# EAGLE design UNDER_FAST (EAGLE 9.6.2)
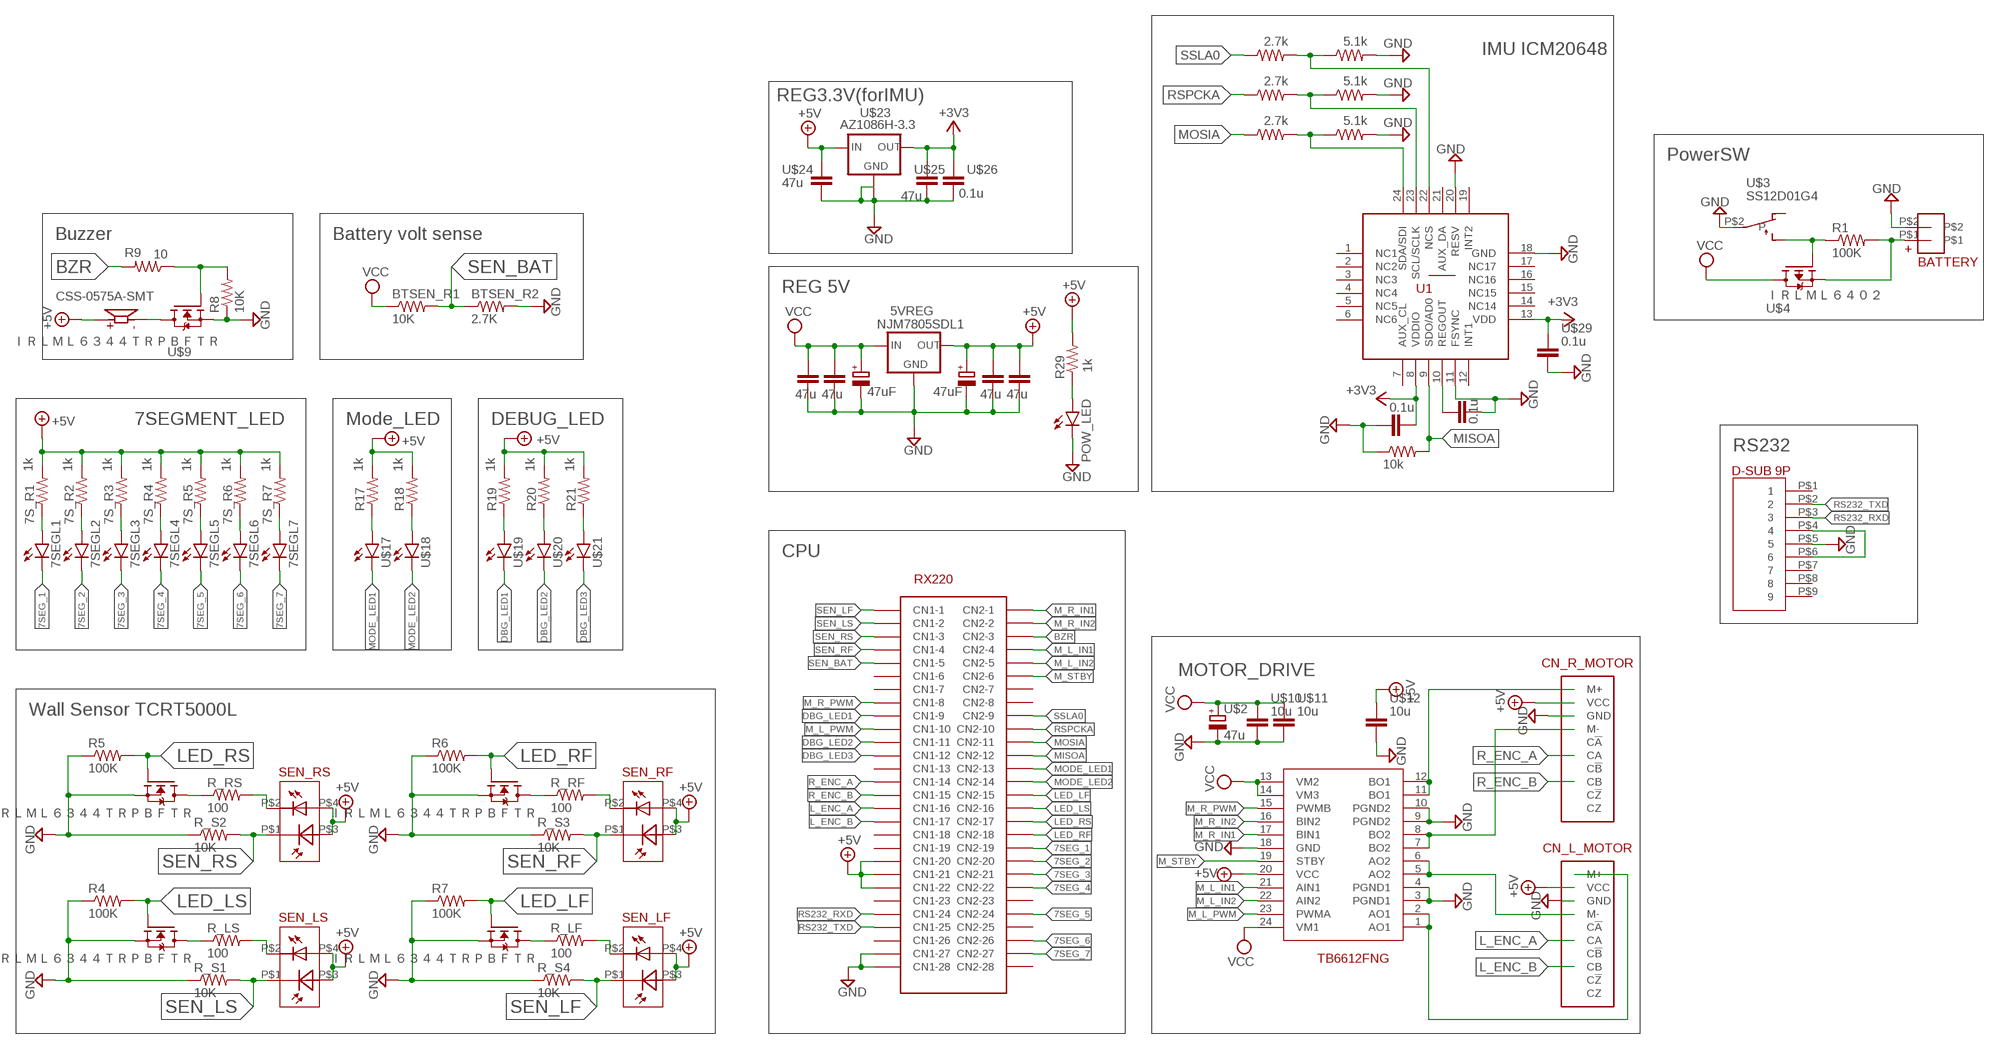
[diagram p0: schematic, sheet 1]

## Parts
5VREG  NJM7805SDL1  [TO252]
7S_R1  1k  ERJ-2RKF1001X  [RESC1005X40N]
7S_R2  1k  ERJ-2RKF1001X  [RESC1005X40N]
7S_R3  1k  ERJ-2RKF1001X  [RESC1005X40N]
7S_R4  1k  ERJ-2RKF1001X  [RESC1005X40N]
7S_R5  1k  ERJ-2RKF1001X  [RESC1005X40N]
7S_R6  1k  ERJ-2RKF1001X  [RESC1005X40N]
7S_R7  1k  ERJ-2RKF1001X  [RESC1005X40N]
7SEGL1  LED1608  [LED1608]
7SEGL2  LED1608  [LED1608]
7SEGL3  LED1608  [LED1608]
7SEGL4  LED1608  [LED1608]
7SEGL5  LED1608  [LED1608]
7SEGL6  LED1608  [LED1608]
7SEGL7  LED1608  [LED1608]
BATTERY  DF3A_2P_2DSA_CONNECTOR  [DF3A_2P_2DSA_CONNECTOR]
BTSEN_R1  10K  ERJ-2RKF1001X  [RESC1005X40N]
BTSEN_R2  2.7K  ERJ-2RKF1001X  [RESC1005X40N]
C1  47u  C3225  [CAPC3225X270N]
C2  47u  C3225  [CAPC3225X270N]
C3  47u  C3225  [CAPC3225X270N]
C4  47u  C3225  [CAPC3225X270N]
CLK_R1  2.7k  ERJ-2RKF1001X  [RESC1005X40N]
CLK_R2  5.1k  ERJ-2RKF1001X  [RESC1005X40N]
CN_L_MOTOR  CN_MOTOR  [CN_MOTOR]
CN_R_MOTOR  CN_MOTOR  [CN_MOTOR]
EC1  47uF  EEE-HC1E470XP  [CAPAE660X800N]
EC2  47uF  EEE-HC1E470XP  [CAPAE660X800N]
LS1  CSS-0575A-SMT  [CUI_CSS-0575A-SMT]
MISO_R  10k  ERJ-2RKF1001X  [RESC1005X40N]
MOSI_R1  2.7k  ERJ-2RKF1001X  [RESC1005X40N]
MOSI_R2  5.1k  ERJ-2RKF1001X  [RESC1005X40N]
NCS_R1  2.7k  ERJ-2RKF1001X  [RESC1005X40N]
NCS_R2  5.1k  ERJ-2RKF1001X  [RESC1005X40N]
POW_LED  LED1608  [LED1608]
R1  100K  ERJ-2RKF1001X  [RESC1005X40N]
R4  100K  ERJ-2RKF1001X  [RESC1005X40N]
R5  100K  ERJ-2RKF1001X  [RESC1005X40N]
R6  100K  ERJ-2RKF1001X  [RESC1005X40N]
R7  100K  ERJ-2RKF1001X  [RESC1005X40N]
R8  10K  ERJ-2RKF1001X  [RESC1005X40N]
R9  10  ERJ-2RKF1001X  [RESC1005X40N]
R17  1k  ERJ-2RKF1001X  [RESC1005X40N]
R18  1k  ERJ-2RKF1001X  [RESC1005X40N]
R19  1k  ERJ-2RKF1001X  [RESC1005X40N]
R20  1k  ERJ-2RKF1001X  [RESC1005X40N]
R21  1k  ERJ-2RKF1001X  [RESC1005X40N]
R29  1k  ERJ-2RKF1001X  [RESC1005X40N]
R_LF  100  ERJ-2RKF1001X  [RESC1005X40N]
R_LS  100  ERJ-2RKF1001X  [RESC1005X40N]
R_RF  100  ERJ-2RKF1001X  [RESC1005X40N]
R_RS  100  ERJ-2RKF1001X  [RESC1005X40N]
R_S1  10K  ERJ-2RKF1001X  [RESC1005X40N]
R_S2  10K  ERJ-2RKF1001X  [RESC1005X40N]
R_S3  10K  ERJ-2RKF1001X  [RESC1005X40N]
R_S4  10K  ERJ-2RKF1001X  [RESC1005X40N]
SEN_LF  TCRT5000L  [TCRT5000L_PHOTO]
SEN_LS  TCRT5000L  [TCRT5000L_PHOTO]
SEN_RF  TCRT5000L  [TCRT5000L_PHOTO]
SEN_RS  TCRT5000L  [TCRT5000L_PHOTO]
TB6612FNG  TB6612FNG  [SOP65P760X160-24N]
U1  ICM-20648  [QFN40P300X300X95-24N]
U$1  RX220_BOARD  [RX220_BOARD]
U$2  47u  EEE-HC1E470XP  [CAPAE660X800N]
U$3  SS12D01G4  [SS12D01G4]
U$4  ＩＲＬＭＬ６４０２  [SOT23]
U$5  ＩＲＬＭＬ６３４４ＴＲＰＢＦＴＲ  [SOT23]
U$6  ＩＲＬＭＬ６３４４ＴＲＰＢＦＴＲ  [SOT23]
U$7  ＩＲＬＭＬ６３４４ＴＲＰＢＦＴＲ  [SOT23]
U$8  ＩＲＬＭＬ６３４４ＴＲＰＢＦＴＲ  [SOT23]
U$9  ＩＲＬＭＬ６３４４ＴＲＰＢＦＴＲ  [SOT23]
U$10  10u  CL31A106KBHNNNE  [CAPC3216X180N]
U$11  10u  CL31A106KBHNNNE  [CAPC3216X180N]
U$12  10u  CL31A106KBHNNNE  [CAPC3216X180N]
U$13  D-SUB  [D-SUB]
U$17  LED1608  [LED1608]
U$18  LED1608  [LED1608]
U$19  LED1608  [LED1608]
U$20  LED1608  [LED1608]
U$21  LED1608  [LED1608]
U$23  AZ1086H-3.3  [SOT223]
U$24  47u  C3225  [CAPC3225X270N]
U$25  47u  C3225  [CAPC3225X270N]
U$26  0.1u  C1005  [CAPC1005X55N]
U$27  0.1u  C1005  [CAPC1005X55N]
U$28  0.1u  C1005  [CAPC1005X55N]
U$29  0.1u  C1005  [CAPC1005X55N]

## Nets
7SEG_1: 7SEGL1.P$2(C) U$1.P$47(CN2-19)
7SEG_2: 7SEGL2.P$2(C) U$1.P$48(CN2-20)
7SEG_3: 7SEGL3.P$2(C) U$1.P$49(CN2-21)
7SEG_4: 7SEGL4.P$2(C) U$1.P$50(CN2-22)
7SEG_5: 7SEGL5.P$2(C) U$1.P$52(CN2-24)
7SEG_6: 7SEGL6.P$2(C) U$1.P$54(CN2-26)
7SEG_7: 7SEGL7.P$2(C) U$1.P$55(CN2-27)
+3V3: U1.8(VDDIO) U1.13(VDD) U$23.2(OUT) U$25.1 U$26.1 U$28.1 U$29.1
+5V: 5VREG.2(OUT) 7S_R1.2 7S_R2.2 7S_R3.2 7S_R4.2 7S_R5.2 7S_R6.2 7S_R7.2 C3.1 C4.1 CN_L_MOTOR.P$2(VCC) CN_R_MOTOR.P$2(VCC) EC2.1(+) LS1.1(P) R17.2 R18.2 R19.2 R20.2 R21.2 R29.2 SEN_LF.P$3(DIODE+) SEN_LF.P$4(LED+) SEN_LS.P$3(DIODE+) SEN_LS.P$4(LED+) SEN_RF.P$3(DIODE+) SEN_RF.P$4(LED+) SEN_RS.P$3(DIODE+) SEN_RS.P$4(LED+) TB6612FNG.20(VCC) U$1.P$20(CN1-20) U$1.P$21(CN1-21) U$1.P$22(CN1-22) U$12.1 U$23.3(IN) U$24.1
BZR: R9.2 U$1.P$31(CN2-3)
DBG_LED1: U$1.P$9(CN1-9) U$19.P$2(C)
DBG_LED2: U$1.P$11(CN1-11) U$20.P$2(C)
DBG_LED3: U$1.P$12(CN1-12) U$21.P$2(C)
GND: 5VREG.3(GND) BATTERY.P$2 BTSEN_R2.2 C1.2 C2.2 C3.2 C4.2 CLK_R2.2 CN_L_MOTOR.P$3(GND) CN_R_MOTOR.P$3(GND) EC1.2(-) EC2.2(-) MISO_R.1 MOSI_R2.2 NCS_R2.2 POW_LED.P$2(C) R4.1 R5.1 R6.1 R7.1 R8.1 R_S1.1 R_S2.1 R_S3.1 R_S4.1 TB6612FNG.3(PGND1) TB6612FNG.4(PGND1) TB6612FNG.9(PGND2) TB6612FNG.10(PGND2) TB6612FNG.18(GND) U1.11(FSYNC) U1.18(GND) U1.20(RESV) U$1.P$27(CN1-27) U$1.P$28(CN1-28) U$2.2(-) U$3.P$2(P) U$5.2(S) U$6.2(S) U$7.2(S) U$8.2(S) U$9.2(S) U$10.2 U$11.2 U$12.2 U$13.P$5 U$23.1(GND) U$23.4(GND1) U$24.2 U$25.2 U$26.2 U$27.2 U$28.2 U$29.2
L_ENC_A: CN_L_MOTOR.P$6(CA) U$1.P$16(CN1-16)
L_ENC_B: CN_L_MOTOR.P$8(CB) U$1.P$17(CN1-17)
LED_LF: R7.2 U$1.P$43(CN2-15) U$8.1(G)
LED_LS: R4.2 U$1.P$44(CN2-16) U$6.1(G)
LED_RF: R6.2 U$1.P$46(CN2-18) U$7.1(G)
LED_RS: R5.2 U$1.P$45(CN2-17) U$5.1(G)
M_L_IN1: TB6612FNG.21(AIN1) U$1.P$32(CN2-4)
M_L_IN2: TB6612FNG.22(AIN2) U$1.P$33(CN2-5)
M_L_PWM: TB6612FNG.23(PWMA) U$1.P$10(CN1-10)
M_R_IN1: TB6612FNG.17(BIN1) U$1.P$29(CN2-1)
M_R_IN2: TB6612FNG.16(BIN2) U$1.P$30(CN2-2)
M_R_PWM: TB6612FNG.15(PWMB) U$1.P$8(CN1-8)
M_STBY: TB6612FNG.19(STBY) U$1.P$34(CN2-6)
MISOA: MISO_R.2 U1.9(SDO/AD0) U$1.P$40(CN2-12)
MODE_LED1: U$1.P$41(CN2-13) U$17.P$2(C)
MODE_LED2: U$1.P$42(CN2-14) U$18.P$2(C)
MOSIA: MOSI_R1.1 U$1.P$39(CN2-11)
N$1: BATTERY.P$1 R1.2 U$4.2(S)
N$2: R1.1 U$3.P$3(ON) U$4.1(G)
N$3: R_LS.2 SEN_LS.P$2(LED-)
N$4: R_LS.1 U$6.3(D)
N$5: R_RS.1 U$5.3(D)
N$6: R_RS.2 SEN_RS.P$2(LED-)
N$7: R_RF.1 U$7.3(D)
N$8: R_RF.2 SEN_RF.P$2(LED-)
N$9: R_LF.1 U$8.3(D)
N$10: R_LF.2 SEN_LF.P$2(LED-)
N$11: CN_R_MOTOR.P$1(M+) TB6612FNG.11(BO1) TB6612FNG.12(BO1)
N$12: R8.2 R9.1 U$9.1(G)
N$13: CN_R_MOTOR.P$4(M-) TB6612FNG.7(BO2) TB6612FNG.8(BO2)
N$14: CN_L_MOTOR.P$4(M-) TB6612FNG.5(AO2) TB6612FNG.6(AO2)
N$15: LS1.2(N) U$9.3(D)
N$16: CN_L_MOTOR.P$1(M+) TB6612FNG.1(AO1) TB6612FNG.2(AO1)
N$17: 7S_R1.1 7SEGL1.P$1(A)
N$18: 7S_R2.1 7SEGL2.P$1(A)
N$19: 7S_R3.1 7SEGL3.P$1(A)
N$20: 7S_R4.1 7SEGL4.P$1(A)
N$21: 7S_R5.1 7SEGL5.P$1(A)
N$22: 7S_R6.1 7SEGL6.P$1(A)
N$23: 7S_R7.1 7SEGL7.P$1(A)
N$24: R17.1 U$17.P$1(A)
N$25: R18.1 U$18.P$1(A)
N$26: R19.1 U$19.P$1(A)
N$27: R20.1 U$20.P$1(A)
N$28: R21.1 U$21.P$1(A)
N$29: U$13.P$4 U$13.P$6
N$30: MOSI_R1.2 MOSI_R2.1 U1.24(SDA/SDI)
N$31: CLK_R1.2 CLK_R2.1 U1.23(SCL/SCLK)
N$32: U1.10(REGOUT) U$27.1
N$33: NCS_R1.2 NCS_R2.1 U1.22(NCS)
N$34: POW_LED.P$1(A) R29.1
R_ENC_A: CN_R_MOTOR.P$6(CA) U$1.P$14(CN1-14)
R_ENC_B: CN_R_MOTOR.P$8(CB) U$1.P$15(CN1-15)
RS232_RXD: U$1.P$24(CN1-24) U$13.P$3
RS232_TXD: U$1.P$25(CN1-25) U$13.P$2
RSPCKA: CLK_R1.1 U$1.P$38(CN2-10)
SEN_BAT: BTSEN_R1.2 BTSEN_R2.1 U$1.P$5(CN1-5)
SEN_LF: R_S4.2 SEN_LF.P$1(DIODE-) U$1.P$1(CN1-1)
SEN_LS: R_S1.2 SEN_LS.P$1(DIODE-) U$1.P$2(CN1-2)
SEN_RF: R_S3.2 SEN_RF.P$1(DIODE-) U$1.P$4(CN1-4)
SEN_RS: R_S2.2 SEN_RS.P$1(DIODE-) U$1.P$3(CN1-3)
SSLA0: NCS_R1.1 U$1.P$37(CN2-9)
VCC: 5VREG.1(IN) BTSEN_R1.1 C1.1 C2.1 EC1.1(+) TB6612FNG.13(VM2) TB6612FNG.14(VM3) TB6612FNG.24(VM1) U$2.1(+) U$4.3(D) U$10.1 U$11.1
Unconnected: CN_L_MOTOR.P$5(C!A) CN_L_MOTOR.P$7(C!B) CN_L_MOTOR.P$9(C!Z) CN_L_MOTOR.P$10(CZ) CN_R_MOTOR.P$5(C!A) CN_R_MOTOR.P$7(C!B) CN_R_MOTOR.P$9(C!Z) CN_R_MOTOR.P$10(CZ) U1.1(NC1) U1.2(NC2) U1.3(NC3) U1.4(NC4) U1.5(NC5) U1.6(NC6) U1.7(AUX_CL) U1.12(INT1) U1.14(NC14) U1.15(NC15) U1.16(NC16) U1.17(NC17) U1.19(INT2) U1.21(AUX_DA) U1.P$2(PAD) U$1.P$6(CN1-6) U$1.P$7(CN1-7) U$1.P$13(CN1-13) U$1.P$18(CN1-18) U$1.P$19(CN1-19) U$1.P$23(CN1-23) U$1.P$26(CN1-26) U$1.P$35(CN2-7) U$1.P$36(CN2-8) U$1.P$51(CN2-23) U$1.P$53(CN2-25) U$1.P$56(CN2-28) U$3.P$1(OFF) U$13.P$1 U$13.P$7 U$13.P$8 U$13.P$9

## Notes on the sheet
- IMU ICM20648
- REG3.3V(forIMU)
- PowerSW
- Buzzer | Battery volt sense
- REG 5V
- 7SEGMENT_LED | Mode_LED | DEBUG_LED
- RS232
- CPU
- MOTOR_DRIVE
- Wall Sensor TCRT5000L

## Library data of the parts
5VREG = regulator:NJM7805SDL1
7S_R1-7S_R7 BTSEN_R1 BTSEN_R2 CLK_R1 CLK_R2 MISO_R MOSI_R1 MOSI_R2 NCS_R1 NCS_R2 R1 R4-R9 R17-R21 R29 R_LF R_LS R_RF R_RS R_S1-R_S4 = Resistor:ERJ-2RKF1001X: RESISTOR, 0402, 0.1W, 1%, 1K; DESCRIPTION: 1 kOhms ±1% 0.1W, 1/10W Chip Resistor 0402 (1005 Metric) Automotive AEC-Q200 Thick Film; DIGI-KEY_PART_NUMBER: P1.00KLCT-ND; MF: Panasonic; MP: ERJ-2RKF1001X; PACKAGE: 1005 Panasonic Electronic Components; PURCHASE-URL: https://pricing.snapeda.com/search/part/ERJ-2RKF1001X/?ref=eda
7SEGL1-7SEGL7 POW_LED U$17-U$21 = LED:LED1608
BATTERY = DF3A_2P_2DSA_CONNECTOR:DF3A_2P_2DSA_CONNECTOR
C1-C4 U$24 U$25 = capacitor:C3225
CN_L_MOTOR CN_R_MOTOR = CN_MOTOR:CN_MOTOR
EC1 EC2 U$2 = capacitor:EEE-HC1E470XP
LS1 = CSS-0575A-SMT:CSS-0575A-SMT: 5 mm, 3 V, 75 dB, Surface Mount (SMT), Magnetic Audio Transducer Buzzer; CUI_PURCHASE_URL: https://www.cuidevices.com/product/audio/buzzers/audio-transducers/css-0575a-smt-tr?utm_source=snapeda.com&utm_medium=referral&utm_campaign=snapedaBOM; DESCRIPTION: 5 mm, 3 V, 76 dB, Surface Mount (SMT), Magnetic Audio Transducer Buzzer; DIGI-KEY_PART_NUMBER: 102-2201-1-ND; MF: CUI Devices; MP: CSS-0575A-SMT-TR; PACKAGE: 6-DIP-6 CUI; PURCHASE-URL: https://pricing.snapeda.com/search/part/CSS-0575A-SMT-TR/?ref=eda
SEN_LF SEN_LS SEN_RF SEN_RS = PHOTO:TCRT5000L
TB6612FNG = TB6612FNG:TB6612FNG
U1 = ICM-20648:ICM-20648: 6-Axis Gyro/Accel Integrated Sol; DESCRIPTION: Accelerometer, Gyroscope, Temperature, 6 Axis Sensor I²C, SPI Output; DIGI-KEY_PART_NUMBER: 1428-1061-1-ND; MF: TDK InvenSense; MP: ICM-20648; PACKAGE: QFN-24 TDK; PURCHASE-URL: https://pricing.snapeda.com/search/part/ICM-20648/?ref=eda
U$1 = CPU:RX220_BOARD
U$3 = SlideSwitch:SS12D01G4
U$4 = FET:ＩＲＬＭＬ６４０２
U$5-U$9 = FET:ＩＲＬＭＬ６３４４ＴＲＰＢＦＴＲ
U$10-U$12 = capacitor:CL31A106KBHNNNE
U$13 = D-SUB:D-SUB
U$23 = regulator:AZ1086H-3.3
U$26-U$29 = capacitor:C1005

## Board
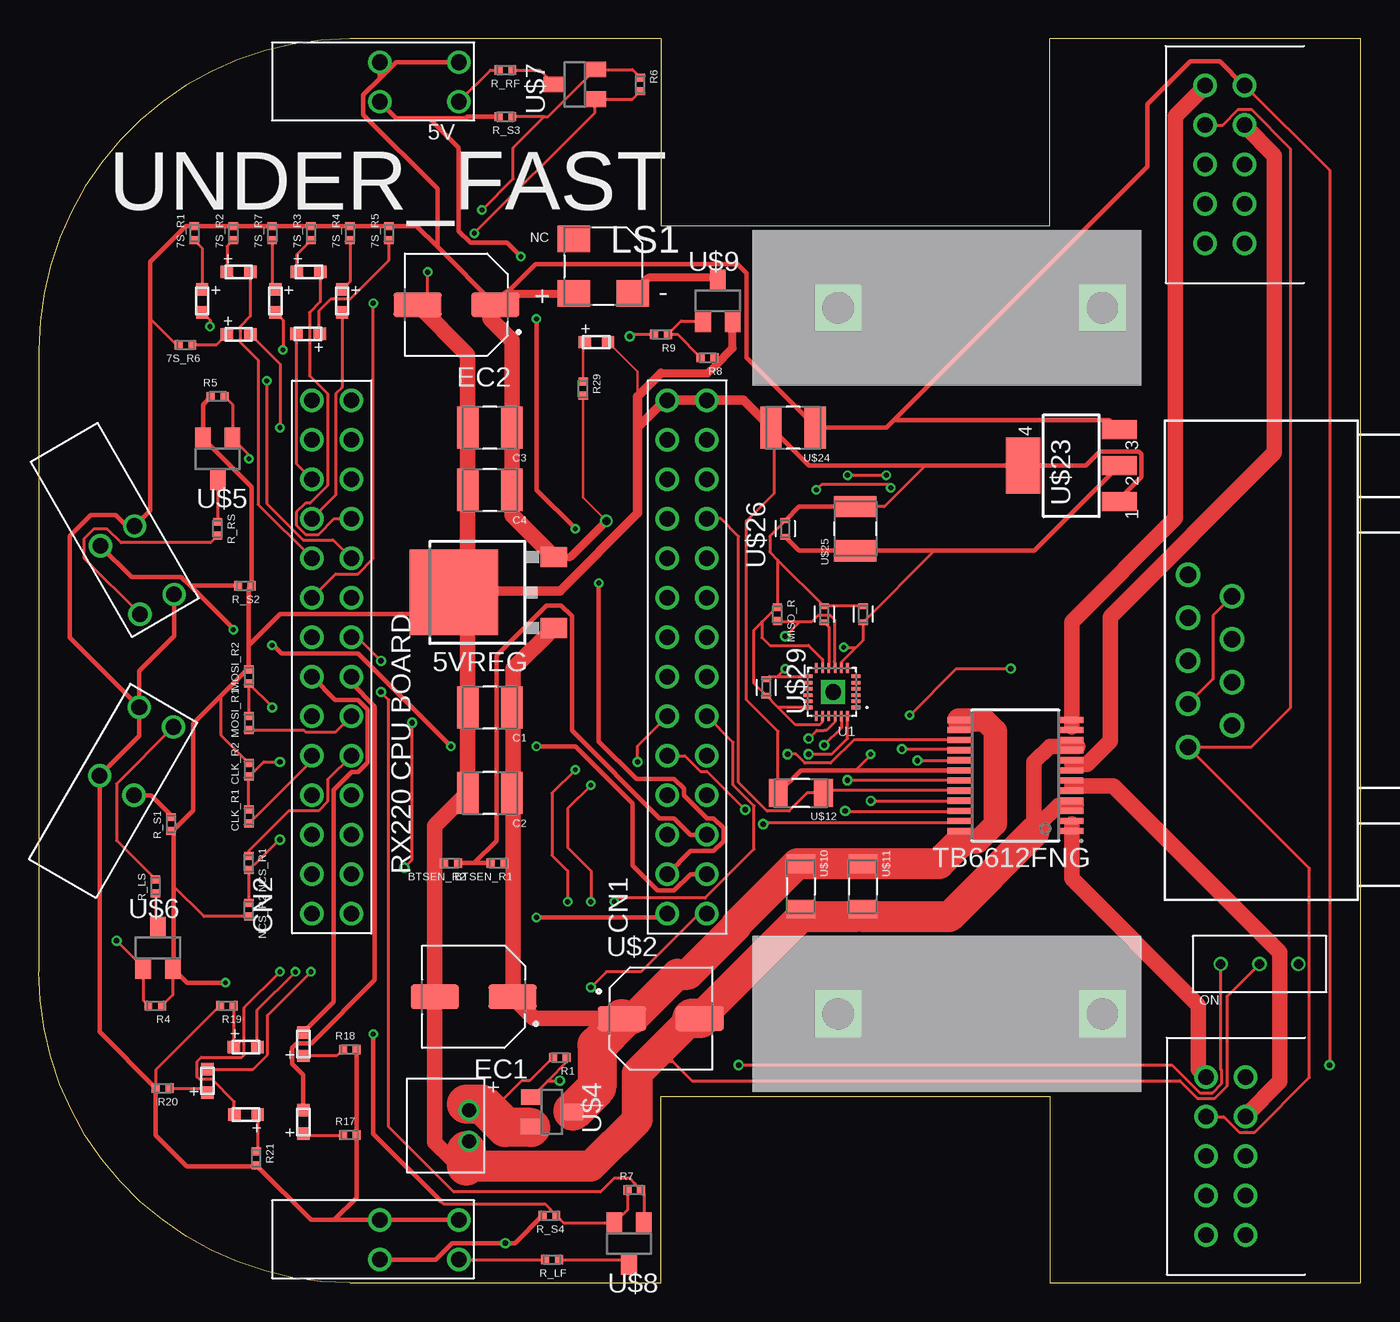
[diagram p1: board, top side]
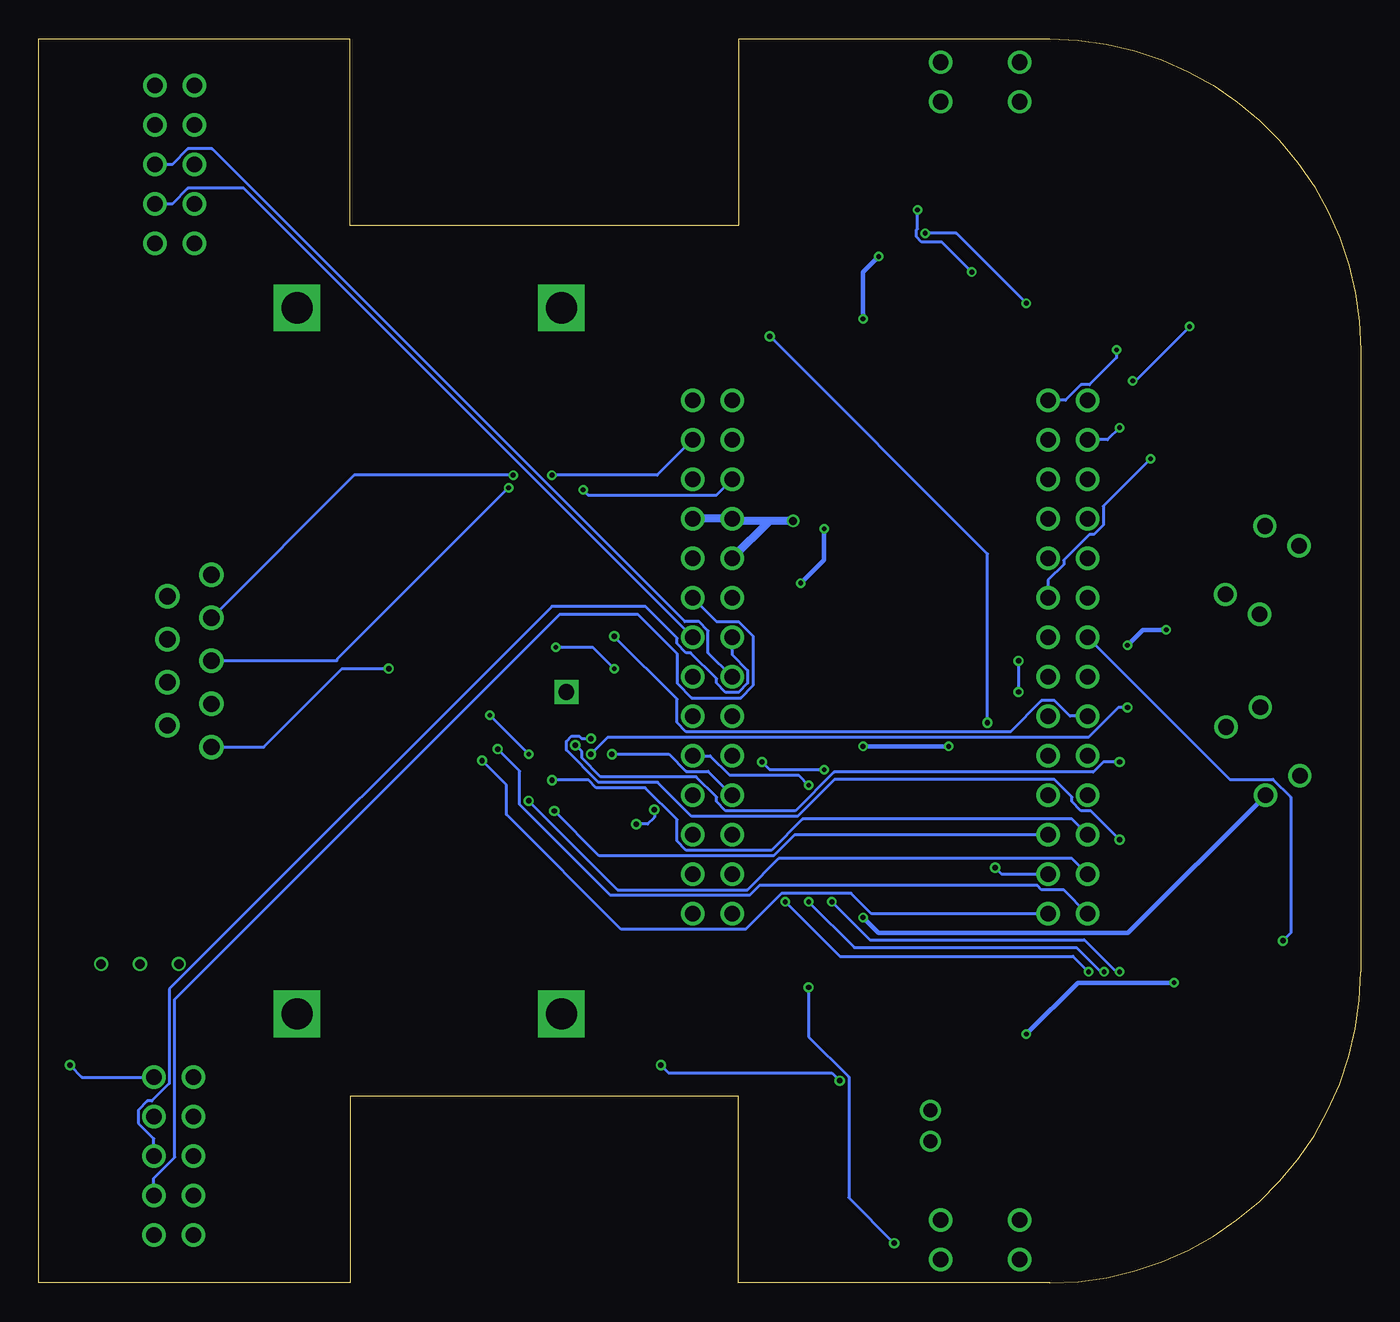
[diagram p2: board, bottom side, seen from below]

Size 85 x 80 mm. Coordinates in mm from the lower left corner, seen from the top.
Outline: 20,0 40,0 40,12 65,12 65,0 85,0 85,80 65,80 65,68 40,68 40,80 20,80 arc90 0,60 0,20 arc90 20,0
Copper layers (1*16): Top 0.035mm / dielectric 1.6mm / Bottom 0.035mm
Design rules "Elecrow_2-layer_PCB_eagle_rule": minimum track width 6mil, minimum drill 12mil, track to track 6mil, track to pad 6mil, pad to pad 6mil, via to via 8mil, smd to smd 0mil, copper to edge 20mil, drill to drill 10mil, minimum pad ring 6mil, minimum via ring 6mil, stop-mask expansion 0mil, vias tented up to drill 100mil, thermal gap 10mil
tKeepout: area 55,22.4 to 68,57.6

### Footprints (pad centres in the part's own frame; a part is rotated, then mirrored left to right if it is on the bottom)
TO252 = smd 1.3 x 1.7: 1 -2.285,-4.22; 2 2.285,-4.22 | smd 5.5 x 5.7: 3 0,2.22
RESC1005X40N = smd 0.51 x 0.6: 1 -0.445,0; 2 0.445,0
LED1608 = smd 0.8 x 0.8: P$1 -0.4,0; P$2 1.1,0
DF3A_2P_2DSA_CONNECTOR = drill 0.9: P$1 0,0; P$2 0,2
CAPC3225X270N = smd 1.37 x 2.72: 1 -1.421,0; 2 1.421,0
CN_MOTOR = drill 1: P$1 0,0; P$2 0,2.54; P$3 2.54,0; P$4 2.54,2.54; P$5 5.08,0; P$6 5.08,2.54; P$7 7.62,0; P$8 7.62,2.54; P$9 10.16,0; P$10 10.16,2.54
CAPAE660X800N = smd 3.11 x 1.58: 1 -2.5,0; 2 2.5,0
CUI_CSS-0575A-SMT = smd 2.1 x 1.7: 1 -1.9,-1.75; 2 1.9,-1.75; 3 -1.9,1.75
TCRT5000L_PHOTO = drill 1: P$1 0,5.08; P$2 0,0; P$3 2.54,5.08; P$4 2.54,0
SOP65P760X160-24N = smd 1.5 x 0.4: 1 -3.625,3.575; 2 -3.625,2.925; 3 -3.625,2.275; 4 -3.625,1.625; 5 -3.625,0.975; 6 -3.625,0.325; 7 -3.625,-0.325; 8 -3.625,-0.975; 9 -3.625,-1.625; 10 -3.625,-2.275; 11 -3.625,-2.925; 12 -3.625,-3.575; 13 3.625,-3.575; 14 3.625,-2.925; 15 3.625,-2.275; 16 3.625,-1.625; 17 3.625,-0.975; 18 3.625,-0.325; 19 3.625,0.325; 20 3.625,0.975; 21 3.625,1.625; 22 3.625,2.275; 23 3.625,2.925; 24 3.625,3.575
QFN40P300X300X95-24N = smd 0.64 x 0.22: 1 -1.545,1; 2 -1.545,0.6; 3 -1.545,0.2; 4 -1.545,-0.2; 5 -1.545,-0.6; 6 -1.545,-1; 13 1.545,-1; 14 1.545,-0.6; 15 1.545,-0.2; 16 1.545,0.2; 17 1.545,0.6; 18 1.545,1 | smd 0.22 x 0.64: 7 -1,-1.545; 8 -0.6,-1.545; 9 -0.2,-1.545; 10 0.2,-1.545; 11 0.6,-1.545; 12 1,-1.545; 19 1,1.545; 20 0.6,1.545; 21 0.2,1.545; 22 -0.2,1.545; 23 -0.6,1.545; 24 -1,1.545 | drill 1 pad 1.54 square: P$2 -0.08,0
RX220_BOARD = drill 1: P$1 0,0; P$2 0,2.54; P$3 2.54,0; P$4 2.54,2.54; P$5 5.08,0; P$6 5.08,2.54; P$7 7.62,0; P$8 7.62,2.54; P$9 10.16,0; P$10 10.16,2.54; P$11 12.7,0; P$12 12.7,2.54; P$13 15.24,0; P$14 15.24,2.54; P$15 17.78,0; P$16 17.78,2.54; P$17 20.32,0; P$18 20.32,2.54; P$19 22.86,0; P$20 22.86,2.54; P$21 25.4,0; P$22 25.4,2.54; P$23 27.94,0; P$24 27.94,2.54; P$25 30.48,0; P$26 30.48,2.54; P$27 33.02,0; P$28 33.02,2.54; P$29 0,22.86; P$30 0,25.4; P$31 2.54,22.86; P$32 2.54,25.4; P$33 5.08,22.86; P$34 5.08,25.4; P$35 7.62,22.86; P$36 7.62,25.4; P$37 10.16,22.86; P$38 10.16,25.4; P$39 12.7,22.86; P$40 12.7,25.4; P$41 15.24,22.86; P$42 15.24,25.4; P$43 17.78,22.86; P$44 17.78,25.4; P$45 20.32,22.86; P$46 20.32,25.4; P$47 22.86,22.86; P$48 22.86,25.4; P$49 25.4,22.86; P$50 25.4,25.4; P$51 27.94,22.86; P$52 27.94,25.4; P$53 30.48,22.86; P$54 30.48,25.4; P$55 33.02,22.86; P$56 33.02,25.4
SS12D01G4 = drill 0.6: P$1 0,0; P$2 2.5,0; P$3 5,0
SOT23 = smd 1 x 1.4: 1 -0.95,-1.306; 2 0.95,-1.306; 3 0,1.306
CAPC3216X180N = smd 1.2 x 1.82: 1 -1.46,0; 2 1.46,0
D-SUB = drill 1.05: P$1 0,0; P$2 2.77,0; P$3 5.54,0; P$4 8.31,0; P$5 11.08,0; P$6 1.385,2.84; P$7 4.155,2.84; P$8 6.925,2.84; P$9 9.695,2.84
SOT223 = smd 1.219 x 2.235: 1 -2.311,-3.099; 2 0,-3.099; 3 2.311,-3.099 | smd 3.6 x 2.2: 4 0,3.099
CAPC1005X55N = smd 0.35 x 0.6: 1 -0.525,0; 2 0.525,0

### Placement (x,y rotation side)
5VREG  28.9,44.4 90 top
7S_R1  10,67.5 90 top
7S_R2  12.5,67.5 90 top
7S_R3  17.5,67.5 90 top
7S_R4  20,67.5 90 top
7S_R5  22.5,67.5 90 top
7S_R6  9.43,60.33 180 top
7S_R7  15,67.5 90 top
7SEGL1  10.5,63.5 270 top
7SEGL2  12.5,65 0 top
7SEGL3  17,65 0 top
7SEGL4  19.5,63.5 270 top
7SEGL5  17.66,61.04 180 top
7SEGL6  12.5,61 0 top
7SEGL7  15.2,63.5 270 top
BATTERY  27.66,11.11 180 top
BTSEN_R1  29.5,27 180 top
BTSEN_R2  26.5,27 180 top
C1  29,37 180 top
C2  29,31.5 180 top
C3  29,55 180 top
C4  29,51 180 top
CLK_R1  13.5,30 90 top
CLK_R2  13.5,33 90 top
CN_L_MOTOR  75.07,13.23 270 top
CN_R_MOTOR  75,77 270 top
EC1  27.96,18.4 180 top
EC2  26.85,62.9 180 top
LS1  36.29,65.38 0 top
MISO_R  47.5,43 270 top
MOSI_R1  13.5,36 90 top
MOSI_R2  13.5,39 90 top
NCS_R1  13.5,27 270 top
NCS_R2  13.5,24 270 top
POW_LED  35.5,60.5 0 top
R1  33.5,14.5 180 top
R4  7.49,17.83 180 top
R5  11.5,57 0 top
R6  38.67,77.07 270 top
R7  38.29,5.97 0 top
R8  43,59.5 180 top
R9  40,61 180 top
R17  20,9.5 0 top
R18  20,15 0 top
R19  12.09,17.83 180 top
R20  7.97,12.52 180 top
R21  13.98,8.01 270 top
R29  35,57.5 270 top
R_LF  33,1.5 180 top
R_LS  7.5,25.5 90 top
R_RF  30,78 180 top
R_RS  11.5,48.5 270 top
R_S1  8.5,29.5 90 top
R_S2  13.25,44.83 180 top
R_S3  30,75 180 top
R_S4  32.83,4.33 180 top
SEN_LF  27,1.5 90 top
SEN_LS  8.65,35.75 150 top
SEN_RF  27,75.96 90 top
SEN_RS  6.5,43 30 top
TB6612FNG  62.8,32.63 180 top
U1  51,38 180 top
U$1  42.96,23.74 90 top
U$2  40,17 0 top
U$3  81,20.5 180 top
U$4  33,11 270 top
U$5  11.5,53 180 top
U$6  7.66,21.54 0 top
U$7  34.46,77.07 90 top
U$8  37.95,2.54 180 top
U$9  43.66,63.16 0 top
U$10  49,25.5 270 top
U$11  53,25.5 270 top
U$12  49,31.5 180 top
U$13  73.9,45.54 270 top
U$17  17,10 90 top
U$18  17,15 90 top
U$19  12.95,15.17 0 top
U$20  10.83,12.64 90 top
U$21  13.67,10.83 180 top
U$23  66.39,52.55 90 top
U$24  48.5,55 180 top
U$25  52.5,48.5 90 top
U$26  48,48.5 90 top
U$27  50.5,43 90 top
U$28  53,43 90 top
U$29  46.78,38.29 270 top

### Tracks (layer width: path | path; a pad name or v marks a point on that pad's centre or on a via)
7SEG_1  (via drill 0.3 pad 0.55)
  Top 0.2: 7SEGL1.P$2 11,61.9 v11,61.5 | U$1.P$47 18.91,47.78 17,47.78 14.65,50.13 v14.65,58
  Bottom 0.2: v11,61.5 14.5,58 v14.65,58
7SEG_2
  Top 0.2: U$1.P$48 14.1,50.06 14.1,59.35 12.95,60.49 12.95,61.51 13.6,62.16 7SEGL2.P$2
7SEG_3
  Top 0.2: 7SEGL3.P$2 18.1,63.1 17.41,62.41 17.41,58.33 18.56,57.17 18.56,51.27 17.44,50.14 17.14,50.14 16.56,49.55 16.56,48.73 17.14,48.14 17.98,48.14 18.98,49.14 U$1.P$49
7SEG_4
  Top 0.2: 7SEGL4.P$2 19.5,57.58 19.1,57.17 19.1,50.68 U$1.P$50
7SEG_5
  Top 0.2: 7SEGL5.P$2 16.56,57.18 16.56,57.17 16.56,52.68 U$1.P$52
7SEG_6  (via drill 0.3 pad 0.55)
  Top 0.2: 7SEGL6.P$2 15.5,59.1 v15.5,55
  Bottom 0.2: v15.5,55 16.28,54.22 U$1.P$54
7SEG_7  (via drill 0.3 pad 0.55)
  Top 0.2: v15.7,60 15.7,61.9 7SEGL7.P$2
  Bottom 0.2: v15.7,60 15.7,59.5 17.44,57.76 17.98,57.76 18.98,56.76 U$1.P$55
+3V3  (via drill 0.3)
  Top 0.2: 58,47.08 57.6,47.08 U$28.1 53,41.32 52.56,40.88 | U1.8 51.6,39.92 52.56,40.88 | U$29.1 46.97,39 47.5,39 | 47.5,39 U1.13 | 47.5,39 v48,39.5 | v51.75,40.88 52.56,40.88
  Top 0.3: U$26.1 48.9,47.08 U$25.1 58,47.08 64.02,47.08 U$23.2
  Bottom 0.2: v48,39.5 49.38,40.88 v51.75,40.88
+5V  (via drill 0.35, 0.5 pad 0.55)
  Top 0.152: v36.5,49 35,50.5 R29.2
  Top 0.2: CN_R_MOTOR.P$2 83,71.54 v83,14 | TB6612FNG.20 50.62,31.66 U$12.1 49.41,31.5 48.24,30.34 46.84,30.34 45,32.17 45,48 43.86,49.14 U$1.P$21 | R19.2 7.53,13.71 R20.2 | 7.16,62 8.83,60.33 7S_R6.2 | EC2.1 29,62.55 29,62
  Top 0.3: 19,4.04 17.5,4.04 R21.2 13.91,7.5 9.5,7.5 7.53,9.47 R20.2 3.91,16.14 SEN_LS.P$3 6.45,35.16 SEN_LS.P$4 | 19,4.04 SEN_LF.P$3 SEN_LF.P$4 | 19,4.04 20.45,5.49 R17.2 R18.2 | U$24.1 50,55 | 50,55 54.5,55 55,55.5 | 55,55.5 68.85,55.5 U$23.3 | 55,55.5 71.3,71.8 71.3,75.78 74.06,78.55 75.94,78.55 77.49,77 CN_R_MOTOR.P$2 | 50,55 45.5,59.5 45.5,64.92 44.92,65.5 41.08,65.5 41.07,65.5 31.95,65.5 EC2.1 25.62,66.62 | SEN_LS.P$4 1.98,41.49 1.98,48.01 3.35,49.38 4.95,49.38 5.66,48.67 SEN_RS.P$3 7.16,49.67 7.16,62 7.16,65.66 9.45,67.94 7S_R1.2 7S_R2.2 7S_R7.2 7S_R3.2 7S_R4.2 7S_R5.2 24.3,67.94 25.62,66.62 | SEN_RS.P$4 8.7,41.6 6.45,39.35 SEN_LS.P$4 | SEN_RF.P$3 21.92,77.45 | 21.92,77.45 20.87,76.4 20.87,75.13 25.62,70.38 25.62,66.62 | SEN_RF.P$4 22.97,78.5 21.92,77.45
  Top 0.5: EC2.1 30.08,63.63 LS1.1 | 5VREG.2 34.19,46.69 v36.5,49
  Top 1: 5VREG.2 30.42,49.38 C4.1 C3.1 30.42,60.58 29,62
  Bottom 0.2: v83,14 82.23,13.23 CN_L_MOTOR.P$2
  Bottom 0.5: U$1.P$21 U$1.P$22 40.28,49 v36.5,49 38.02,49 U$1.P$20
BZR  (via drill 0.35)
  Top 0.2: v23.5,26.7 24,27.2 v24,36.02 | v38,60.87 38.13,61 R9.2
  Bottom 0.2: U$1.P$31 23.08,26.28 v23.5,26.7 | v24,36.02 24,46.87 v38,60.87
DBG_LED1  (via drill 0.3)
  Top 0.2: U$19.P$2 14.05,17.55 v16.5,20 | v35.5,32 34,30.5 34,28 35.5,26.5 v35.5,24.5
  Bottom 0.2: v16.5,20 16.71,20 18.27,21.56 32.56,21.56 v35.5,24.5 | v35.5,32 36.15,32.65 40.59,32.65 41.84,33.9 U$1.P$9
DBG_LED2  (via drill 0.3)
  Top 0.2: U$20.P$2 13.78,13.74 14.7,14.66 14.7,17.2 v17.5,20 | v37,24.5 37.25,24.75 42.85,24.75 46,27.9 46,30.68 44.65,32.03 44.65,34.75 U$1.P$11
  Bottom 0.2: v37,24.5 33.5,21 18.5,21 v17.5,20
DBG_LED3  (via drill 0.3, 0.35)
  Top 0.2: U$21.P$2 12.57,11.66 11.14,13.09 10.32,13.09 10.18,13.23 10.18,14.24 10.45,14.52 13.05,14.52 13.2,14.66 13.2,17.7 v15.5,20 | v34.5,33 33,31.5 33,27.5 34,26.5 v34,24.5 | v38.5,33.5 38.5,34.52 U$1.P$12
  Bottom 0.2: v15.5,20 15.71,20 17.77,22.06 31.56,22.06 v34,24.5 | v38.5,33.5 38,33 v34.5,33
GND  (via drill 0.3, 0.3 pad 0.55, 0.35)
  Top 0.152: POW_LED.P$2 38.5,58.6 38.5,57
  Top 0.2: BTSEN_R2.2 25.46,27 | TB6612FNG.3 TB6612FNG.4 66.73,30.7 | 27.5,8.5 27.5,8.95 BATTERY.P$2 | U$10.2 49,23.54 | 52.5,23.54 U$11.2 53,23.54 | TB6612FNG.10 66.83,34.5 | 66.42,34.5 TB6612FNG.9 | 39.25,14.25 40.75,14.25 42,13 73.38,13 74.51,11.88 75.63,11.88 76.42,12.67 76.42,18.43 U$3.P$2 | CN_L_MOTOR.P$3 76.19,10.69 77.19,9.69 78.19,9.69 81.7,13.21 81.7,26.66 U$13.P$5 77.96,34.46 80.5,37 80.5,72.92 77.95,75.46 77.12,75.46 76.12,74.46 CN_R_MOTOR.P$3 | 57,52.55 54.37,49.92 U$25.2 | U$28.2 U$27.2 50.48,43.52 47.5,46.5 | U$26.2 47,48.02 47,47 47.5,46.5 | 47.55,37 48.66,35.88 50.2,35.88 50.4,36.08 U1.20 | 47.55,37 U$29.2 46,38.55 46,42 46.5,42.5 | 47.5,46.5 MISO_R.1 47.45,43.45 46.5,42.5 | 46.5,42.5 46.5,41.5 47,41 49.5,41 50.4,40.1 U1.11 | U$12.2 47.54,35.46 45.5,37.5 45.5,49 47.29,50.79 47.29,54.79 | U$6.2 8.61,18.5 R4.1 | R6.1 38.16,78.02 U$7.2 32.75,75 32.5,75 | 32.5,75 R_S3.1 | NCS_R2.2 10.62,23.55 8.67,25.5 | CLK_R2.2 11.73,35.21 11.73,37.77 | EC2.2 25,63.55 v25,65 | 32.5,75 30.5,73 30.5,71 v28.5,69 | R7.1 37.84,4.69 U$8.2 33.76,3.85 R_S4.1 32.89,4.71 32.89,4.74 32.57,5.06 26.04,5.06 25.85,5.25 | 5VREG.3 25.28,43 24,43 | U1.18 47.55,37 | 52.5,32.95 53.5,33.95 v53.5,34 | v56,36.5 59,39.5 v62.5,39.5
  Top 0.3: U$23.1 69.49,50.4 70.91,51.81 70.91,53.28 70.73,53.46 68.25,53.46 67.33,52.55 U$23.4 57,52.55 49.53,52.55 47.29,54.79 U$24.2 | U$25.2 48.9,49.92 U$26.2 | TB6612FNG.18 52.5,32.95 48.99,32.95 U$12.2 | v21.5,16 21.5,9.6 25.85,5.25 | R_S1.1 8.67,28.88 | 8.67,28.88 8.67,25.5 8.67,20.17 U$6.2 9.54,19.3 v12,19.3 | 8.67,28.88 8.67,29.13 9.93,30.39 9.93,35.97 11.73,37.77 13.41,39.45 MOSI_R2.2 13.5,41 | 13.5,41 13.5,44.63 R_S2.1 13.7,51.16 U$5.2 10.55,56.49 R5.1 | 13.5,41 15.5,43 24,43
  Top 0.5: 40,58.5 43,58.5 43.5,59 | U$9.2 44.61,60.11 43.5,59 | R8.1 43.5,59.45 43.5,59
  Top 0.6: 5VREG.3 26.78,44.5 33.5,44.5 38.5,49.5 38.5,55 | 38.5,55 40.26,56.76 U$1.P$28 U$1.P$27 45.32,56.76 U$24.2 | 40,58.5 38.5,57 38.5,55
  Top 1: BATTERY.P$2 26.55,8 26.5,8 25.46,9.04 EC1.2 25.46,27 25.46,29.38 C2.2 C1.2 27.58,43.5 5VREG.3 27.58,45.3 C4.2 C3.2 27.58,59.67 EC2.2 | 64,29.5 64,33.5 65,34.5 66.42,34.5 66.83,34.5 | 64,29.5 64,29 | 66.73,30.7 65.55,30.7 64.35,29.5 64,29.5
  Top 2: 42,17 39.25,14.25 38.49,13.49 38.49,10.5 35.49,7.5 27.5,7.5 | U$2.2 42.5,17.04 49,23.54 52.5,23.54 | 53,23.54 58.54,23.54 64,29
  Top 2.5: 27.5,7.5 27.5,8.5
  Top 2.54: U$2.2 42,17
  Bottom 0.2: v28.5,69 28.5,67.79 28.56,67.73 28.56,67.27 28.23,66.94 26.94,66.94 v25,65 | U$13.P$5 70.54,34.46 65.5,39.5 v62.5,39.5 | v53.5,34 v56,36.5
  Bottom 0.3: v12,19.3 18.2,19.3 v21.5,16
L_ENC_A
  Bottom 0.2: CN_L_MOTOR.P$6 77.61,9.27 78.61,10.28 78.61,11.11 78.03,11.69 77.73,11.69 76.61,12.81 76.61,18.89 52,43.5 46,43.5 43.96,41.46 43.96,41.1 43.38,40.52 43.08,40.52 41.42,38.86 41.42,38.56 40.84,37.98 40.01,37.98 39.42,38.56 39.42,39.4 40.42,40.4 U$1.P$16
L_ENC_B
  Bottom 0.2: U$1.P$17 41.42,42.52 40.01,42.52 39.06,41.58 39.06,38.42 39.86,37.62 43.02,37.62 43.96,38.56 43.96,40.46 46.5,43 51.5,43 76.25,18.25 76.25,8.09 77.61,6.73 CN_L_MOTOR.P$8
LED_LF  (via drill 0.35)
  Top 0.2: U$8.1 38.9,5.8 R7.2 38.35,6.35 38.35,6.38 38.01,6.72 36.99,6.72 36.11,5.85 26.68,5.85 22.5,10.03 22.5,37.5 v22,38 | U$1.P$43 20.48,41.52 v22,40
  Bottom 0.2: v22,40 v22,38
LED_LS  (via drill 0.35)
  Top 0.2: R4.2 6.71,18.16 U$6.1 6.71,20.29 v5,22
  Bottom 0.2: U$1.P$44 8.42,32.38 5.64,32.38 4.5,31.24 4.5,22.5 v5,22
LED_RF  (via drill 0.3)
  Top 0.2: R6.2 38.16,76.12 U$7.1 35.77,75.27 v28,67.5 | U$1.P$46 19.1,45.6 20.52,45.6 21.5,46.58 v21.5,63
  Bottom 0.2: v21.5,63 26,67.5 v28,67.5
LED_RS  (via drill 0.3)
  Top 0.2: R5.2 12.45,56.49 U$5.1 13.5,53.26 v13.5,53
  Bottom 0.2: v13.5,53 16.56,49.94 16.56,48.73 17.14,48.14 17.44,48.14 19.1,46.48 19.1,46.19 20.1,45.18 U$1.P$45
M_L_IN1  (via drill 0.35)
  Top 0.2: v53.5,31 v53.51,31 TB6612FNG.21
  Bottom 0.2: U$1.P$32 18.56,27.28 37.44,27.28 39.44,25.28 47.78,25.28 v53.5,31
M_L_IN2  (via drill 0.35)
  Top 0.2: v51.85,30.35 51.9,30.3 59.12,30.3 TB6612FNG.22
  Bottom 0.2: U$1.P$33 36.4,28.82 37.75,27.46 48.97,27.46 v51.85,30.35
M_L_PWM  (via drill 0.35)
  Top 0.2: v45.42,30.43 42.96,32.9 42.55,32.9 41.54,33.9 U$1.P$10 | v46.58,29.5 46.62,29.5 46.72,29.61 59.08,29.61 TB6612FNG.23
  Bottom 0.2: v45.42,30.43 45.42,29.93 45.85,29.5 v46.58,29.5
M_R_IN1  (via drill 0.35)
  Top 0.2: v56.5,33.59 59.16,33.59 TB6612FNG.17
  Bottom 0.2: U$1.P$29 31.45,23.74 32.77,25.06 37.23,25.06 39.55,22.74 47.56,22.74 54.93,30.11 54.93,32.02 v56.5,33.59
M_R_IN2  (via drill 0.35)
  Top 0.2: v55.5,34.33 59.1,34.33 TB6612FNG.16
  Bottom 0.2: U$1.P$30 19.1,25.28 20.52,25.28 20.8,25.56 38.66,25.56 39.3,24.93 48.24,24.93 54.08,30.76 54.08,32.91 v55.5,34.33
M_R_PWM  (via drill 0.35)
  Top 0.2: TB6612FNG.15 52.4,34.91 50.92,33.42 49.26,33.42 48.68,34 v48.15,34
  Bottom 0.2: v48.15,34 44.48,34 43.38,32.9 41.96,32.9 U$1.P$8
M_STBY  (via drill 0.35)
  Top 0.2: v52,32.33 59.16,32.33 TB6612FNG.19
  Bottom 0.2: v52,32.33 49.64,32.33 49.16,31.84 46.01,31.84 43.96,29.8 43.96,28.41 43.38,27.82 37.9,27.82 35.89,29.82 18.56,29.82 U$1.P$34
MISOA  (via drill 0.35)
  Top 0.2: MISO_R.2 47.5,42.5 48.92,42.5 | 48.92,42.5 49.69,42.5 50.09,42.9 50.91,42.9 51.15,42.65 51.15,39.96 51.16,39.95 51.16,39.58 U1.9 | v48,41.58 48.92,42.5
  Bottom 0.2: U$1.P$40 18.68,36.44 19.68,37.44 20.52,37.44 22.52,35.44 43.38,35.44 43.96,36.02 43.96,37.54 v48,41.58
MODE_LED1
  Top 0.3: U$17.P$2 17,13.37 16.3,14.07 16.3,15.12 16.57,15.4 17.52,15.4 21.61,19.48 21.61,37.06 20.1,38.57 U$1.P$41
MODE_LED2
  Top 0.3: U$18.P$2 18.96,18.07 18.96,31.71 20.1,32.85 20.54,32.85 21.15,33.46 21.15,36.88 20.54,37.49 19.05,37.49 U$1.P$42
MOSIA
  Top 0.2: MOSI_R1.1 17.03,35.55 17.14,35.44 19.1,35.44 U$1.P$39
N$1
  Top 0.2: R1.2 31.55,13 31.05,13 29.52,11.47 28.02,11.47 BATTERY.P$1 27.5,11.27 27.5,11.5 | U$4.2 31.64,10
  Top 2.5: 31.64,10 30,10 28.5,11.5 27.5,11.5
N$2  (via drill 0.35)
  Top 0.2: R1.1 33.95,14.2 32.74,13 | 32.74,13 U$4.1 | 32.74,13 v33.5,13 | U$3.P$3 76,13.72 76.07,13.64 76.07,12.81 75.48,12.23 74.66,12.23 72.88,14 v45,14
  Bottom 0.2: v45,14 44.5,13.5 34,13.5 v33.5,13
N$3
  Top 0.2: SEN_LS.P$2 5,32.1 5,28.45 R_LS.2
N$4
  Top 0.2: R_LS.1 7.5,23.01 U$6.3
N$5
  Top 0.2: U$5.3 R_RS.1
N$6
  Top 0.2: R_RS.2 11.04,47.59 5.29,47.59 4.41,48.48 3.51,48.48 2.88,47.84 2.88,46.62 SEN_RS.P$2
N$7
  Top 0.2: R_RF.1 32.22,78 U$7.3
N$8
  Top 0.2: SEN_RF.P$2 29.04,78 R_RF.2
N$9
  Top 0.2: R_LF.1 37.68,1.5 U$8.3
N$10
  Top 0.2: SEN_LF.P$2 R_LF.2
N$11
  Top 0.2: 66.42,35.76 TB6612FNG.11
  Top 1: CN_R_MOTOR.P$1 75,76.94 73.1,75.04 73.1,49.17 66.42,42.5 TB6612FNG.12 66.42,35.76
N$12
  Top 0.2: U$9.1 41.3,61.85 R9.1 41.05,61 R8.2
N$13
  Top 0.2: TB6612FNG.8 66.42,33.35 TB6612FNG.7
  Top 1: CN_R_MOTOR.P$4 77.54,74.4 79.44,72.5 79.44,53.39 68.89,42.84 68.89,34.85 67.39,33.35 66.42,33.35
N$14
  Top 0.2: TB6612FNG.6 66.42,31.96 TB6612FNG.5
  Top 1: CN_L_MOTOR.P$4 77.61,10.75 79.81,12.95 79.81,21.25 69.11,31.96 66.42,31.96
N$15
  Top 0.5: LS1.2 39.19,64.63 43.5,64.63 U$9.3
N$16
  Top 0.2: TB6612FNG.2 66.42,29.5
  Top 1: CN_L_MOTOR.P$1 74.57,13.73 74.57,17.86 66.42,26 66.42,29.5 TB6612FNG.1
N$17
  Top 0.2: 7S_R1.1 10.5,66.56 7SEGL1.P$1
N$18
  Top 0.2: 7S_R2.1 12.1,66.66 7SEGL2.P$1
N$19
  Top 0.2: 7SEGL3.P$1 16.6,66.16 7S_R3.1
N$20
  Top 0.2: 7S_R4.1 20,64.4 7SEGL4.P$1
N$21
  Top 0.2: 7S_R5.1 22.5,65.74 20,63.25 18.75,63.25 18,62.5 18,61.1 7SEGL5.P$1
N$22
  Top 0.2: 7S_R6.1 11.43,60.33 7SEGL6.P$1
N$23
  Top 0.2: 7S_R7.1 15,64.1 7SEGL7.P$1
N$24
  Top 0.2: U$17.P$1 17.1,9.5 R17.1
N$25
  Top 0.2: R18.1 19.16,14.6 U$18.P$1
N$26
  Top 0.2: R19.1 12.54,15.19 U$19.P$1
N$27
  Top 0.2: R20.1 10.55,12.52 U$20.P$1
N$28
  Top 0.2: U$21.P$1 14.07,8.54 R21.1
N$29
  Top 0.2: U$13.P$6 75.5,42.91 75.5,38.83 U$13.P$4
N$30  (via drill 0.35)
  Top 0.2: MOSI_R1.2 MOSI_R2.1 15,37.05 v15,37 | v49.5,34 51,34 52,35 U1.24
  Bottom 0.2: v15,37 15.58,37 17.5,35.09 48.41,35.09 v49.5,34
N$31  (via drill 0.35)
  Top 0.2: CLK_R1.2 CLK_R2.1 13.88,32.94 13.9,32.94 14.47,33.5 v15.5,33.5 | U1.23 51.6,35.68 v50.5,34.58
  Bottom 0.2: v50.5,34.58 50.08,34.16 50.08,33.76 48.87,32.55 42.73,32.55 41.42,31.24 41.42,30.95 40.84,30.36 36.35,30.36 33.87,32.84 17.2,32.84 16.54,33.5 v15.5,33.5
N$32
  Top 0.2: U$27.1 50.8,42.17 U1.10
N$33  (via drill 0.35)
  Top 0.2: NCS_R2.1 NCS_R1.2 13.88,26.94 13.9,26.94 15.47,28.5 v15.5,28.5 | v49.5,35 50.03,35.53 50.5,35.53 50.65,35.53 51.2,36.08 U1.22
  Bottom 0.2: v15.5,28.5 17.36,30.36 17.98,30.36 18.56,30.95 18.56,31.24 19.68,32.36 33.85,32.36 36.21,30 43.02,30 45.21,32.19 49.01,32.19 51.08,34.26 51.08,34.82 50.74,35.16 50.26,35.16 50.1,35 v49.5,35
N$34
  Top 0.152: R29.1 35,60.4 POW_LED.P$1
N$36  (via drill 2)
  other vias: 51.4,62.7
N$37  (via drill 2)
  other vias: 68.4,62.7
N$38  (via drill 2)
  other vias: 51.4,17.3
N$39  (via drill 2)
  other vias: 68.4,17.3
R_ENC_A
  Bottom 0.2: U$1.P$14 41.96,40.52 41.96,41.94 42.55,42.52 43.46,42.52 73.86,72.92 75.42,72.92 76.42,71.92 CN_R_MOTOR.P$6
R_ENC_B
  Bottom 0.2: CN_R_MOTOR.P$8 76.42,69.38 75.42,70.38 71.82,70.38 U$1.P$15
RS232_RXD  (via drill 0.3)
  Top 0.2: v54.79,51.13 54.59,51.33 50.33,51.33 v50,51
  Bottom 0.2: v54.79,51.13 65.84,40.08 65.84,40 U$13.P$3 | v50,51 49.68,50.68 41.42,50.68 U$1.P$24
RS232_TXD  (via drill 0.3)
  Top 0.2: v52,51.94 v54.5,51.94
  Bottom 0.2: U$1.P$25 45.24,51.94 v52,51.94 | v54.5,51.94 64.73,51.94 U$13.P$2
RSPCKA
  Top 0.2: CLK_R1.1 13.88,29.94 13.9,29.94 17.56,33.59 U$1.P$38
SEN_BAT
  Top 0.3: BTSEN_R2.1 28,27 | 28,27 BTSEN_R1.2 | U$1.P$5 41.91,28.82 40.86,29.87 39.92,29.87 34.27,35.52 34.27,42.89 33.59,43.57 32.65,43.57 29.43,40.36 29.43,28.43 28,27
SEN_LF  (via drill 0.35)
  Top 0.2: U$1.P$1 42.46,23.74 38.72,20 36.5,20 v35.5,19
  Top 0.3: SEN_LF.P$1 25.51,1.5 26.56,2.55 v30,2.55 30.61,2.55 R_S4.2
  Bottom 0.2: v35.5,19 35.5,15.82 32.92,13.24 32.92,5.47 v30,2.55
SEN_LS  (via drill 0.3)
  Top 0.3: SEN_LS.P$1 7.21,31.35 8.5,30.06 R_S1.2 | U$1.P$2 40.18,23.5 v32,23.5
  Bottom 0.3: v32,23.5 31,22.5 14.96,22.5 SEN_LS.P$1
SEN_RF  (via drill 0.3)
  Top 0.3: R_S3.2 27.53,75 27.44,74.91 25.09,74.91 | SEN_RF.P$1 22.97,74.91 25.09,74.91 | v36,45 36,34.83 38.42,32.41 40.86,32.41 41.47,31.8 41.47,31.36 42.96,29.87 43.4,29.87 44.01,29.26 44.01,28.38 43.4,27.77 41.91,27.77 U$1.P$4 | v34.5,48.5 32,51 v32,62 | v31,66 30.11,66.89 27.75,66.89 27,67.64 27,73 25.09,74.91
  Bottom 0.3: v36,45 34.5,46.5 v34.5,48.5 | v31,66 32,65 v32,62
SEN_RS  (via drill 0.3)
  Top 0.3: 9.74,44.83 R_S2.2 | 9.74,44.83 9.17,45.4 5.96,45.4 SEN_RS.P$1 | 9.74,44.83 12.5,42.07 v12.5,42 | v32,34.5 34.5,34.5 38.17,30.83 38.17,26.83 39.77,25.23 40.86,25.23 41.91,26.28 U$1.P$3 | v15,41 15.09,41 15.62,40.47 20.53,40.47 v26.5,34.5
  Bottom 0.3: v12.5,42 14,42 v15,41 | v26.5,34.5 v32,34.5
SSLA0
  Top 0.2: U$1.P$37 18.56,32.36 18.56,30.95 17.98,30.36 16.07,30.36 13.5,27.79 NCS_R1.1
VCC
  Top 0.2: 30.5,31.5 C2.1 30.48,31.5 30.49,31.49 | BTSEN_R1.1 30.49,27 | TB6612FNG.24 59.17,28.35 59.17,28.25 | TB6612FNG.13 TB6612FNG.14 | U$4.3 34.35,11.04
  Top 1: 30.49,31.49 30.49,27 30.49,18.43 EC1.1 31.86,17 U$2.1 | 30.5,31.5 30.5,36.92 C1.1 30.5,37.08 30.5,39.49 5VREG.1
  Top 1.5: TB6612FNG.13 60.8,36.2 61.5,35.5 61.5,29.5 60.35,28.35 59.17,28.35
  Top 2: 59.17,28.25 57.88,26.96 U$11.1 U$10.1 48.78,26.96 44.86,23.04 44.86,22.95 41.75,19.84 41.04,19.84 38.2,17 U$2.1
  Top 2.5: U$2.1 37.5,16.9 35.89,15.29 35.89,12.58 34.35,11.04

### Text on the board
tPlace: 5V
tNames: UNDER_FAST